# Altium schematic sheet Smart Ballast T8.SchDoc
size 420 x 297 mm; DrawnBy: Лазарев В.П.; SheetTotal: 1; PageSetup: Record=PageOptions|CenterHorizontal=True|CenterVertical=True|PrintScale=0.98|XCorrection=1.00|YCorrection=1.00|PrintKind=0|BorderSize=5000000|LeftOffset=0|BottomOffset=0|Orientation=2|PaperLength=1000|PaperWidth=1000|Scale=100|PaperSource=260|PrintQuality=600|MediaType=1|DitherType=10|PaperKind=A3|PrintScaleMode=1
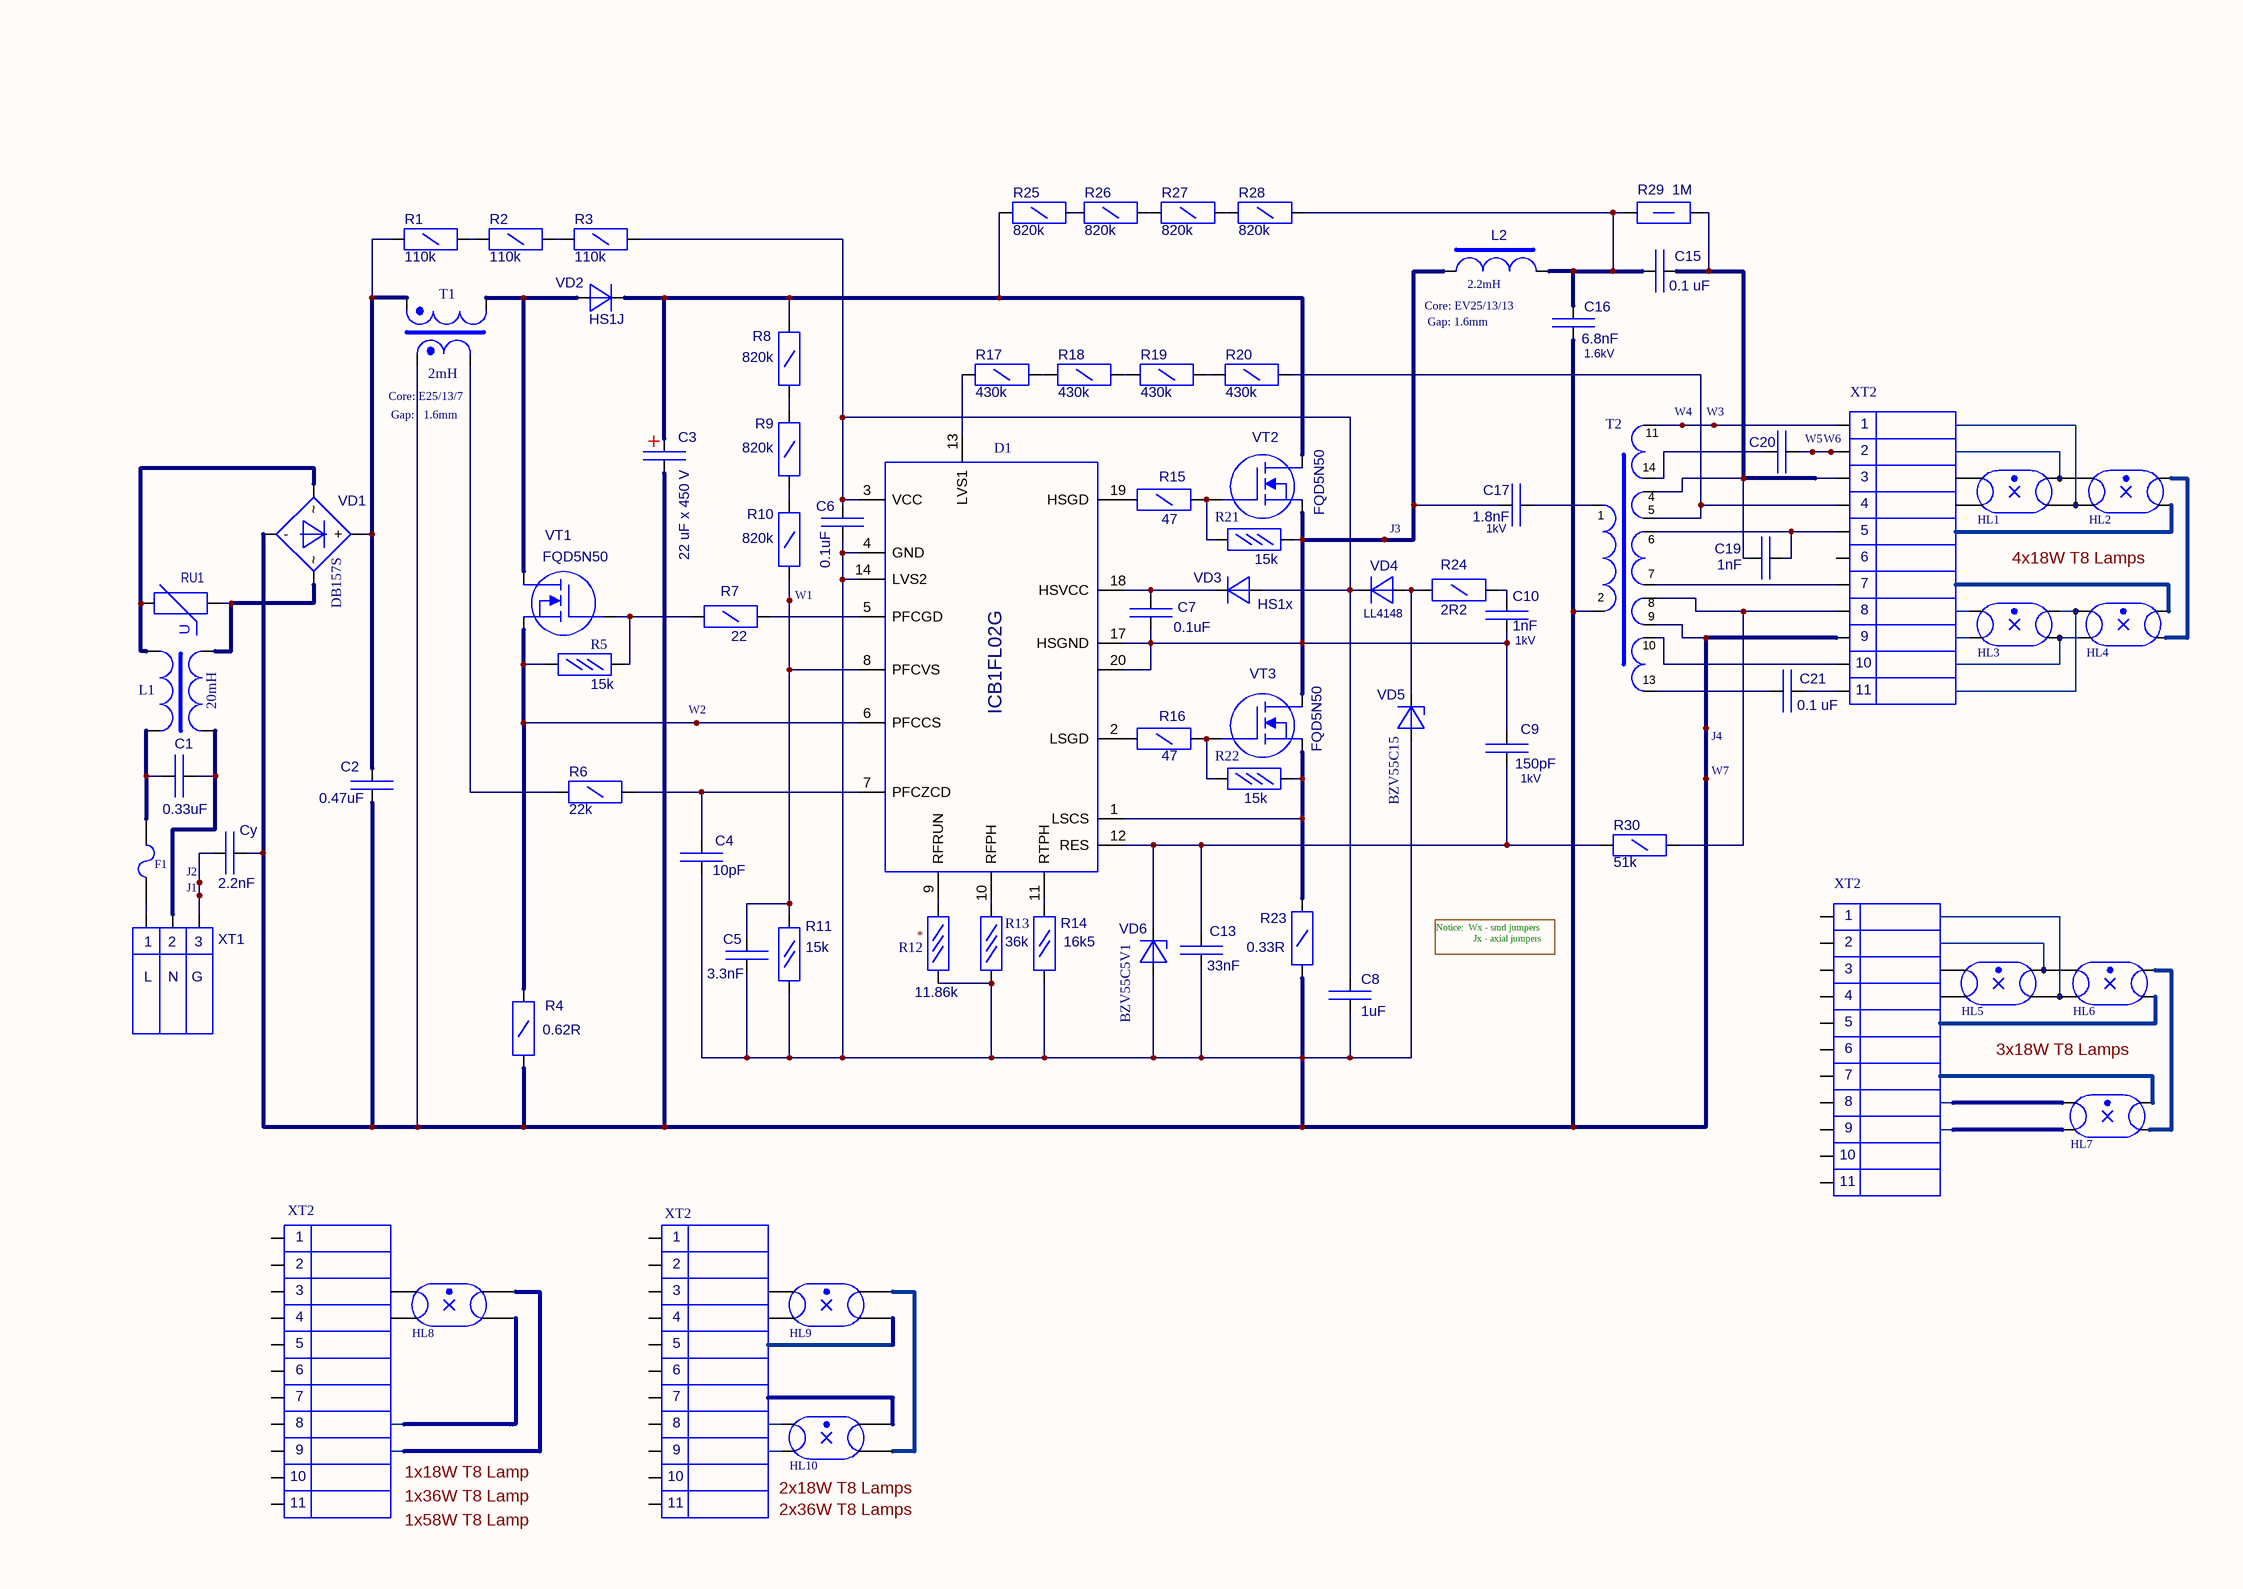
[diagram p0: Smart Ballast T8.SchDoc]

## Parts
(Parts that share a designator on the sheet are numbered #1, #2 ... from top to bottom, then left to right.)
C1  value 0.33uF  [CAPR9.0x18.0-15.0]  (hidden comment: Cap_MKP)
C2  value 0.47uF  [CAPR9.0x18.0-15.0]  (hidden comment: Cap_MKP)
C3  value 22 uF x 450 V  [CAPPR 5-13x25]  (hidden comment: Cap Pol)
C4  value 10pF  [CAPC2012 (0805)]  (hidden comment: Cap_SMD)
C5  value 3.3nF  [CAPC2012 (0805)]  (hidden comment: Cap_SMD)
C6  value 0.1uF  [CAPC2012 (0805)]  (hidden comment: Cap_SMD)
C7  value 0.1uF  [CAPC2012 (0805)]  (hidden comment: Cap_SMD)
C8  value 1uF  [CAPC3216N]  (hidden comment: Cap_SMD)
C9  value 150pF  Voltage: 1kV  [CAPR5.0x13.0-5.0]  (hidden comment: Cap1)
C10  value 1nF  Voltage: 1kV  [CAPR5.0x13.0-5.0]  (hidden comment: Cap1)
C13  value 33nF  [CAPC2012 (0805)]  (hidden comment: Cap_SMD)
C15  value 0.1 uF  [CAPR5.0x13.0-7.5]  (hidden comment: Cap1)
C16  value 6.8nF  Voltage: 1.6kV  [CAPR9.0x18.0-15.0(FKP- 1)]  (hidden comment: Cap1)
C17  value 1.8nF  Voltage: 1kV  [CAPR5.0x13.0-5.0]  (hidden comment: Cap1)
C19  value 1nF  [CAPR5.0x13.0-5.0]  (hidden comment: Cap1)
C20  Cap1  [CAPR5.0x13.0-7.5]  (value not drawn)
C21  value 0.1 uF  [CAPR5.0x13.0-7.5]  (hidden comment: Cap1)
Cy  value 2.2nF  [CAPR Y - 7.5]  (hidden comment: Cap (Y))
D1  ICB1FL02G  [PG-DSO-18-2]
F1  Fuse3  [Fuse - PCB]  (value not drawn)  (net tie, no BOM)
HL1  Lamp Lum  (value not drawn)
HL2  Lamp Lum  (value not drawn)
HL3  Lamp Lum  (value not drawn)
HL4  Lamp Lum  (value not drawn)
HL5  Lamp Lum  (value not drawn)
HL6  Lamp Lum  (value not drawn)
HL7  Lamp Lum  (value not drawn)
HL8  Lamp Lum  (value not drawn)
HL9  Lamp Lum  (value not drawn)
HL10  Lamp Lum  (value not drawn)
J1  Jumper_1  [AXIAL- Jumper_9.5mm]  (value not drawn)  (net tie)
J2  Jumper_1  [AXIAL- Jumper_9.5mm]  (value not drawn)  (net tie)
J3  Jumper_1  [AXIAL- Jumper_9.5mm]  (value not drawn)  (net tie)
J4  Jumper_1  [AXIAL- Jumper_15.0mm]  (value not drawn)  (net tie)
L1  Value2: 20mH  [EMIF-E20-V]  (hidden comment: Trans EMI)
L2  Core: EV25/13/13  Gap: 1.6mm  Value2: 2.2mH  [RI-EVD25-13-G]  (hidden comment: RI-EVD25-2mH-1.6g.H)
R1  value 110k  [RESC3216(1206)N]  (hidden comment: Res 1/4W)
R2  value 110k  [RESC3216(1206)N]  (hidden comment: Res 1/4W)
R3  value 110k  [RESC3216(1206)N]  (hidden comment: Res 1/4W)
R4  value 0.62R  [AXIAL-0.5W Long pin_21mm]  (hidden comment: Res 1/4W)
R5  value 15k  [RESC1608(0603)]  (hidden comment: Res 1/16W)
R6  value 22k  [RESC3216(1206)N]  (hidden comment: Res 1/4W)
R7  value 22  [RESC3216(1206)N]  (hidden comment: Res 1/4W)
R8  value 820k  [RESC3216(1206)N]  (hidden comment: Res 1/4W)
R9  value 820k  [RESC3216(1206)N]  (hidden comment: Res 1/4W)
R10  value 820k  [RESC3216(1206)N]  (hidden comment: Res 1/4W)
R11  value 15k  [RESC3216(1206)N]  (hidden comment: Res 1/8W)
R12  value 11.86k  [RESC1608(0603)]  (hidden comment: Res 1/16W)
R13  value 36k  [RESC1608(0603)]  (hidden comment: Res 1/16W)
R14  value 16k5  [RESC2012(0805)]  (hidden comment: Res 1/8W)
R15  value 47  [RESC3216(1206)N]  (hidden comment: Res 1/4W)
R16  value 47  [RESC3216(1206)N]  (hidden comment: Res 1/4W)
R17  value 430k  [RESC3216(1206)N]  (hidden comment: Res 1/4W)
R18  value 430k  [RESC3216(1206)N]  (hidden comment: Res 1/4W)
R19  value 430k  [RESC3216(1206)N]  (hidden comment: Res 1/4W)
R20  value 430k  [RESC3216(1206)N]  (hidden comment: Res 1/4W)
R21  value 15k  [RESC1608(0603)]  (hidden comment: Res 1/16W)
R22  value 15k  [RESC1608(0603)]  (hidden comment: Res 1/16W)
R23  value 0.33R  [AXIAL-0.5W Long pin_21mm]  (hidden comment: Res 1/4W)
R24  value 2R2  [RESC3216(1206)N]  (hidden comment: Res 1/4W)
R25  value 820k  [RESC3216(1206)N]  (hidden comment: Res 1/4W)
R26  value 820k  [RESC3216(1206)N]  (hidden comment: Res 1/4W)
R27  value 820k  [RESC3216(1206)N]  (hidden comment: Res 1/4W)
R28  value 820k  [RESC3216(1206)N]  (hidden comment: Res 1/4W)
R29  value 1M  [RES12.7-8.5X3.3]  (hidden comment: Res 1/2W)
R30  value 51k  [RESC3216(1206)N]  (hidden comment: Res 1/4W)
RU1  Varistor  [VAristor 7.5-11x5]  (value not drawn)
T1  Value2: 2mH  Core: E25/13/7  Gap: 1.6mm  [PFC-E25-G]  (hidden comment: 'PFC-E25-2mH-1,6g.H)
T2  VRI-E16  [VRI-E16-8-G]  (value not drawn)
VD1  value DB157S  [DB-1S]  (hidden comment: Diode Bridge)
VD2  value HS1J  [CD4532-1812 (mod)]  (hidden comment: Diode1)
VD3  value HS1x  [CD4532-1812]  (hidden comment: Diode HS1x)
VD4  value LL4148  [MELF-D3516-1406]  (hidden comment: Diode LL4148)
VD5  value BZV55C15  [MELF-D3516-1406]  (hidden comment: Diode Zener)
VD6  value BZV55C5V1  [MELF-D3516-1406]  (hidden comment: Diode Zener)
VT1  FQD5N50  [D-PAK (TO252)]
VT2  FQD5N50  [D-PAK (TO252)]
VT3  FQD5N50  [D-PAK (TO252)]
W1  Jumper_1  [Jumper-Res1206]  (value not drawn)  (net tie)
W2  Jumper_1  [Jumper-Res1206]  (value not drawn)  (net tie)
W3  Jumper_1  [Jumper-Res1206]  (value not drawn)  (net tie)
W4  Jumper_1  [Jumper-Res1206]  (value not drawn)  (net tie)
W5  Jumper_1  [Jumper-Res1206]  (value not drawn)  (net tie)
W6  Jumper_1  [Jumper-Res1206]  (value not drawn)  (net tie)
W7  Jumper_1  [Jumper-Res1206]  (value not drawn)  (net tie)
XT1  Connect x3  [ZIP-Ballast3]  (value not drawn)
XT2#1  Connect x11  [ZIP-Ballast11]  (value not drawn)
XT2#2  Connect x11  [ZIP-Ballast11]  (value not drawn)  (graphical)
XT2#3  Connect x11  [ZIP-Ballast11]  (value not drawn)  (graphical)
XT2#4  Connect x11  [ZIP-Ballast11]  (value not drawn)  (graphical)

## Nets
NetC1_1: C1.1 L1.4(Pri+) XT1.2
NetC1_2: C1.2 F1.2 L1.1(Sec+)
NetC2_1: C2.1 R1.2 T1.1(Pri+) VD1.3(+)
NetC2_2: C2.2 C3.2 C4.2 C5.1 C6.2 C8.2 C13.2 C16.2 Cy.2 D1.4(GND) D1.14(LVS2) J4.1(W*) R4.1 R11.2 R12.1 R13.1 R14.1 R23.1 T1.8(Sec+) T2.2(Pri_A-) T2.9(Sec-) VD1.4(-) VD5.1 VD6.1 W7.1(W*) XT2#1.9(9a)
NetC3_1: C3.1 R8.2 R25.1 VD2.2 VT2.2(D)
NetC4_1: C4.1 D1.7(PFCZCD) R6.1
NetC5_2: C5.2 D1.8(PFCVS) R10.2 R11.1 W1.1(W*)
NetC6_1: C6.1 C8.1 D1.3(VCC) R3.2 VD3.1 VD4.2
NetC7_1: C7.1 C9.1 C10.2 C17.1 D1.17(HSGND) D1.20(HSGND) J3.1(W*) L2.1(Pri+) R21.2 VT2.3(S) VT3.2(D)
NetC7_2: C7.2 D1.18(HSVCC) VD3.2
NetC9_2: C9.2 C13.1 D1.12(RES) R30.1 VD6.2
NetC10_1: C10.1 R24.2
NetC15_1: C15.1 C16.1 L2.5(Pri-) R28.2 R29.2
NetC15_2: C15.2 C19.1 R29.1 T2.4(Sec+) XT2#1.3(3a)
NetC17_2: C17.2 T2.1(Pri_A+)
NetC19_2: C19.2 T2.6(Sec_C+) XT2#1.5(5a)
NetC20_1: C20.1 T2.11(Sec_F-)
NetC20_2: C20.2 W5.1(W*) W6.1(W*) XT2#1.2(2a)
NetC21_1: C21.1 T2.13(Sec_E-)
NetC21_2: C21.2 XT2#1.11(11a)
NetCy_1: Cy.1 J1.1(W*) J2.1(W*) XT1.3
NetD1_1: D1.1(LSCS) R22.1 R23.2 VT3.3(S)
NetD1_2: D1.2(LSGD) R16.1
NetD1_5: D1.5(PFCGD) R7.2
NetD1_6: D1.6(PFCCS) R4.2 R5.2 VT1.3(S) W2.1(W*)
NetD1_9: D1.9(RFRUN) R12.2
NetD1_10: D1.10(RFPH) R13.2
NetD1_11: D1.11(RTPH) R14.2
NetD1_13: D1.13(LVS1) R17.1
NetD1_19: D1.19(HSGD) R15.1
NetF1_1: F1.1 XT1.1
NetL1_2: L1.2(Sec-) RU1.2 VD1.2
NetL1_3: L1.3(Pri-) RU1.1 VD1.1
NetR1_1: R1.1 R2.2
NetR2_1: R2.1 R3.1
NetR5_1: R5.1 R7.1 VT1.1(G)
NetR6_2: R6.2 T1.6(Sec-)
NetR8_1: R8.1 R9.2
NetR9_1: R9.1 R10.1
NetR15_2: R15.2 R21.1 VT2.1(G)
NetR16_2: R16.2 R22.2 VT3.1(G)
NetR17_2: R17.2 R18.1
NetR18_2: R18.2 R19.1
NetR19_2: R19.2 R20.1
NetR20_2: R20.2 T2.5(Sec-) XT2#1.4(4a)
NetR24_1: R24.1 VD4.1 VD5.2
NetR25_2: R25.2 R26.1
NetR26_2: R26.2 R27.1
NetR27_2: R27.2 R28.1
NetR30_2: R30.2 T2.8(Sec+) XT2#1.8(8a)
NetT1_4: T1.4(Pri-) VD2.1 VT1.2(D)
NetT2_7: T2.7(Sec)C-) XT2#1.7(7a)
NetT2_10: T2.10(Sec_E+) XT2#1.10(10a)
NetT2_14: T2.14(Sec_F+) W3.1(W*) W4.1(W*) XT2#1.1(1a)

Not connected (* = marked no-connect by the designer): HL1 1 2 3 4; HL2 1 2 3 4; HL3 1 2 3 4; HL4 1 2 3 4; HL5 1 2 3 4; HL6 1 2 3 4; HL7 1 2 3 4; HL8 1 2 3 4; HL9 1 2 3 4; HL10 1 2 3 4; XT2#1 6(6a); XT2#2 1(1a) 2(2a) 3(3a) 4(4a) 5(5a) 6(6a) 7(7a) 8(8a) 9(9a) 10(10a) 11(11a); XT2#3 1(1a) 2(2a) 3(3a) 4(4a) 5(5a) 6(6a) 7(7a) 8(8a) 9(9a) 10(10a) 11(11a); XT2#4 1(1a) 2(2a) 3(3a) 4(4a) 5(5a) 6(6a) 7(7a) 8(8a) 9(9a) 10(10a) 11(11a)

## Notes on the sheet
- (near T2) 11
- (near XT2#1) 1
- (near XT2#1) 2
- (near T2) 1
- (near T2) 14
- (near T2) 4
- (near T2) 5
- (near XT2#1) 3
- (near XT2#1) 4
- (near T2) 7
- (near T2) 6
- (near XT2#1) 5
- (near XT2#1) 6
- (near XT2#1) 7
- 4x18W T8 Lamps
- (near T2) 2
- (near T2) 10
- (near T2) 8
- (near T2) 9
- (near XT2#1) 10
- (near XT2#1) 8
- (near XT2#1) 9
- (near T2) 13
- (near XT2#1) 11
- (near XT2#2) 1
- (near XT1) 1
- (near XT1) L
- (near XT1) 2
- (near XT1) N
- (near XT1) G
- (near XT1) 3
- (near R12) *
- Notice:  Wx - smd jumpers
  Jx - axial jumpers
- (near XT2#2) 2
- (near XT2#2) 3
- (near XT2#2) 4
- (near XT2#2) 5
- (near XT2#2) 6
- 3x18W T8 Lamps
- (near XT2#2) 7
- (near XT2#2) 8
- (near XT2#2) 9
- (near XT2#2) 10
- (near XT2#2) 11
- (near XT2#3) 1
- (near XT2#3) 2
- (near XT2#4) 1
- (near XT2#4) 2
- (near XT2#3) 3
- (near XT2#3) 4
- (near XT2#4) 3
- (near XT2#4) 4
- (near XT2#3) 5
- (near XT2#3) 6
- (near XT2#3) 7
- (near XT2#4) 5
- (near XT2#4) 6
- (near XT2#4) 7
- (near XT2#3) 8
- (near XT2#3) 9
- (near XT2#4) 8
- (near XT2#4) 9
- (near XT2#3) 10
- (near XT2#3) 11
- 1x18W T8 Lamp
- 1x36W T8 Lamp
- 1x58W T8 Lamp
- (near XT2#4) 10
- (near XT2#4) 11
- (near HL10) 2x18W T8 Lamps
- (near HL10) 2x36W T8 Lamps
- (in symbol Varistor) U

## Library data of the parts
C1 C2 = Cap_MKP: Cap DIP (MKP); Voltage: 275VAC/400VDV; Function: EMI Filter; Tolerance: 20%; Dielectric: Polypropylene (MKP) - X2 class; PackageDescription: Radial, Thru-Hole Body 9.0x18.0x18.0mm(WxLxH), Pin Spacing 15.0mm; Supplier 1: *; Supplier Part Number 1: *
C3 = Cap Pol: Cap Pol GOST; Tolerance: 10%; Function: Electrolytic Aluminum Capasitor; Supplier: *; PackageDescription: Radial, Thru-Hole Body 13.0x25.0 (DxH)mm, Pin Spacing 5.0mm
C4 C13 = Cap_SMD: Ceramic; Voltage: 25V; Tolerance %: 10%; Dielectric: X7R; PackageDescription: SMD CC0805; Function: *; Supplier: *; Supplier Part Number: *
C5 C7 = Cap_SMD: Ceramic; Voltage: 50V; Tolerance %: 10%; Dielectric: X7R; PackageDescription: SMD CC0805; Function: *; Supplier: *; Supplier Part Number: *
C6 = Cap_SMD: Ceramic; Tolerance: 10%; Dielectric: X7R; Voltage: *; PackageDescription: SMD CC0805; Function: *; Supplier: *; Supplier Part Number: *
C8 = Cap_SMD: Ceramic; Voltage: 100V; Tolerance %: 10%; Dielectric: X7R; PackageDescription: SMD CC1206; Function: *; Supplier: *; Supplier Part Number: *
C9 = Cap1: Capacitor GOST; Tolerance: 10 %; Dielectrik: Ceramic; PackageDescription: Radial Disk Capacitor; Package Reference: Radial Capacitor,Thru-Hole Disk Body. Pin Spacing 5.0 mm; Function: *; Part Number: *; Supplier: *; Supplier Part Number: *
C10 = Cap1: Capacitor GOST; Tolerance: 10 %; Dielectrik: Polypropyline/Ceramic; PackageDescription: Radial Capacitor; Package Reference: Capacitor Thru-Hole Disk Body Pin Spacing 5.0 mm; Function: *; Part Number: *; Supplier: *; Supplier Part Number: *
C15 = Cap1: Capacitor GOST; Part Number: MKP1J031004J; Voltage: 400 VDC; Function: CDC; Dielectric: MKP10 (WIMA); Tolerance: 10%; PackageDescription: Radial Capasitor
C16 = Cap1: Capacitor GOST; Part Number: ECWH16562J; Function: CRES; Dielectric: Polypropylene; Tolerance: 5%; PackageDescription: Radial Capacitor; Package Reference: WIMA FKP-1
C17 = Cap1: Capacitor GOST; Tolerance: 10 %; Dielectrik: Polypropyline; PackageDescription: Radial Capacitor; Package Reference: Capacitor class X 2,Thru-Hole Body 5.0 x 13.0 mm (WxT) Pin Spacing 5.0 mm; Function: *; Part Number: *; Supplier: *; Supplier Part Number: *
C19 = Cap1: Capacitor GOST; Voltage: 1kV; Tolerance: 10 %; Dielectrik: Polypropyline; PackageDescription: Radial Capacitor; Package Reference: Capacitor class X 2,Thru-Hole Body 5.0 x 13.0 mm (WxT) Pin Spacing 5.0 mm; Function: *; Part Number: *; Supplier: *; Supplier Part Number: *
C20 = Cap1: Capacitor GOST; Part Number: MKP1J031004J; Voltage: 250 V; Function: CDC; Value: 0.1 uF; Dielectric: MetalFilmCapacitor; Tolerance: 10%; PackageDescription: Radial Capasitor
C21 = Cap1: Capacitor GOST; Part Number: MKP1J031004J; Voltage: 250 V; Function: CDC; Dielectric: MetalFilmCapacitor; Tolerance: 10%; PackageDescription: Radial Capasitor
Cy = Cap (Y): Disc Ceramic; Voltage: 275VAC/400VDV; Function: Y-capacitor; Tolerance %: 20%; Dielectric: Ceramic Y1-class; PackageDescription: Radial, Disc Body , Pin Spacing 7.5mm; Supplier 1: *; Supplier Part Number 1: *
D1 = ICB1FL02G: IC Ballast; Functuion: *; PackageReference: *; Supplier 1: Digi-Key; Supplier 2: Digi-Key; Supplier Part Number 2: ICB1FL02G-ND; Supplier 3: Mouser; Supplier Part Number 3: 726-ICB1FL02G; Value: ICB1FL02G
F1 = Fuse3: Fuse GOST
HL1-HL10 = Lamp Lum: Lamp Lum GOST; Value: *
J1-J4 W1-W7 = Jumper_1: Jumper Wire
  J1-J4: PackageDescription: Radial Cap, Thru-Hole; 2 Leads; 0.2 in Pin Spacing
  W1-W7: PackageDescription: R1206
L1 = Trans EMI: Trans EMI (GOST); Function: EMI Filter; Value: EMIF-E20-V-20; PackageDescription: B82731T2801A020 (Epcos)
L2 = Choke Ballast-EVD25(S): EVD25-13; Function: Choke Ballast; PackageDescription: EVD25-13; Value: RI-EVD25-2mH-1.6g.H
R1-R3 = Res 1/4W: Resistor GOST; Function: Start-Up; Tolerance: 5%; PackageReference: *; Part Number: *
  R1: PackageDescription: Chip Resistor, Body 3.2x1.6mm
  R2 R3: PackageDescription: Chip Resistor, Body 3.2x1.6mm,
R4 R23 = Res 1/4W: Resistor GOST; Tolerance: 1%; PackageDescription: Axial Device, Thru-Hole; 2 Leads;  Pin Spacing 21мм; PackageReference: AXIAL; Function: *; Part Number: *
  R4: Power: 1/4W
R5 R21 R22 = Res 1/16W: CR0603 GOST; Tolerance: 10%; PackageDescription: Chip 0603; PackageReference: RC0603; Part Number: *
R6 R7 R15 R16 R24 = Res 1/4W: Resistor GOST; Tolerance: 10%; PackageDescription: Chip Resistor, Body 3.2x1.6mm.; PackageReference: *; Function: *; Part Number: *
R8-R10 R17-R20 R25-R28 R30 = Res 1/4W: Resistor GOST; Tolerance: 5%; PackageReference: *; Function: *; Part Number: *
  R8-R10 R17-R20 R25-R28: PackageDescription: Chip Resistor, Body 3.2x1.6mm,
  R30: PackageDescription: Chip Resistor, Body 3.2x1.6mm.
R11 = Res 1/8W: Resistor GOST; Tolerance: 10%; PackageDescription: Chip Resistor, Body 3.2x1.6mm.; PackageReference: *; Part Number: *
R12 R13 = Res 1/16W: CR0603 GOST; Tolerance: 1%; PackageDescription: Chip 0603; PackageReference: RC0603; Part Number: *
R14 = Res 1/8W: Resistor GOST; Tolerance: 1%; PackageDescription: Chip Resistor, Body 2.0x1.3mm,; PackageReference: *; Part Number: *
R29 = Res 1/2W: Resistor GOST; Tolerance: 10%; PackageDescription: Resistor, Axial; Body 8.5 x 3.3 mm (LxDia. max), Lead Dia. 0.7 mm (max); PackageReference: *; Part Number: *
RU1 = Varistor: Varistor GOST; Part Number: ERZ-V05D471; Function: Transient Suppressor; Value: *; PackageReference: Varistor, Thru-Hole, Disc; Body 11 x 5 mm (LxW max) Pin Spacing 7.5 mm (typ)
T1 = PFC Choke E25: PFC-E25-G; Function: PFC Choke; PackageDescription: E-25-10-13; Value: 'PFC-E25-2mH-1,6g.H
T2 = Choke Ballast-VRI-E16: VRI-E16-8-G; Function: Choke Ballast Voltage Preheat; PackageDescription: E16-8-5-G; Value: VRI-E16
VD1 = Diode Bridge: Diode Bridge GOST; PackageReference: *; PackageDescription: *; Part Number: *; Function: *; Supplier 1: Mouser; Supplier Part Number 1: 583-DB157SC
VD2 = Diode1: Diode GOST; Part Number: *; PackageDescription: Chip Diode; Body 4.5 x 3.2 mm (LxW typ); PackageReference: *; Function: *
VD3 = Diode HS1x: Diode HS1x (GOST); Package Description: Chip Diode; Body 4.5 x 3.2 mm (LxW typ); Part Number: *; Function: *
VD4 = Diode LL4148: Diode LL4148 (GOST); Package Description: Metal Electrode Face (MELF) Diode; Body 3.5 x 1.7 mm (LxDia); Part Number: *; Function: *
VD5 = Diode Zener: Diode Zener GOST; Function: Zener Diode 15.6V; PackageReference: *; PackageDescription: Metal Electrode Face (MELF) Diode; Body 3.5 x 1.7 mm (LxDia); Part Number: *
VD6 = Diode Zener: Diode Zener GOST; Function: Zener Diode 5.1V; PackageReference: *; PackageDescription: Metal Electrode Face (MELF) Diode; Body 3.5 x 1.7 mm (LxDia); Part Number: *
VT1-VT3 = FQD5N50: MOSFET N-channel (GOST); Function: MOSFET N-channel 500V/1.4Ohm; Part Number: *; Value: FQD5N50; Package Description: D-PAK (TO-252); Package Reference: *
XT1 = Connect x3: Connect x3 GOST; Function: Input connector
XT2#1-XT2#4 = Connect x11: Connect x11 GOST